# Altium project Hands_free_ControlUnit_V1.PrjPCB
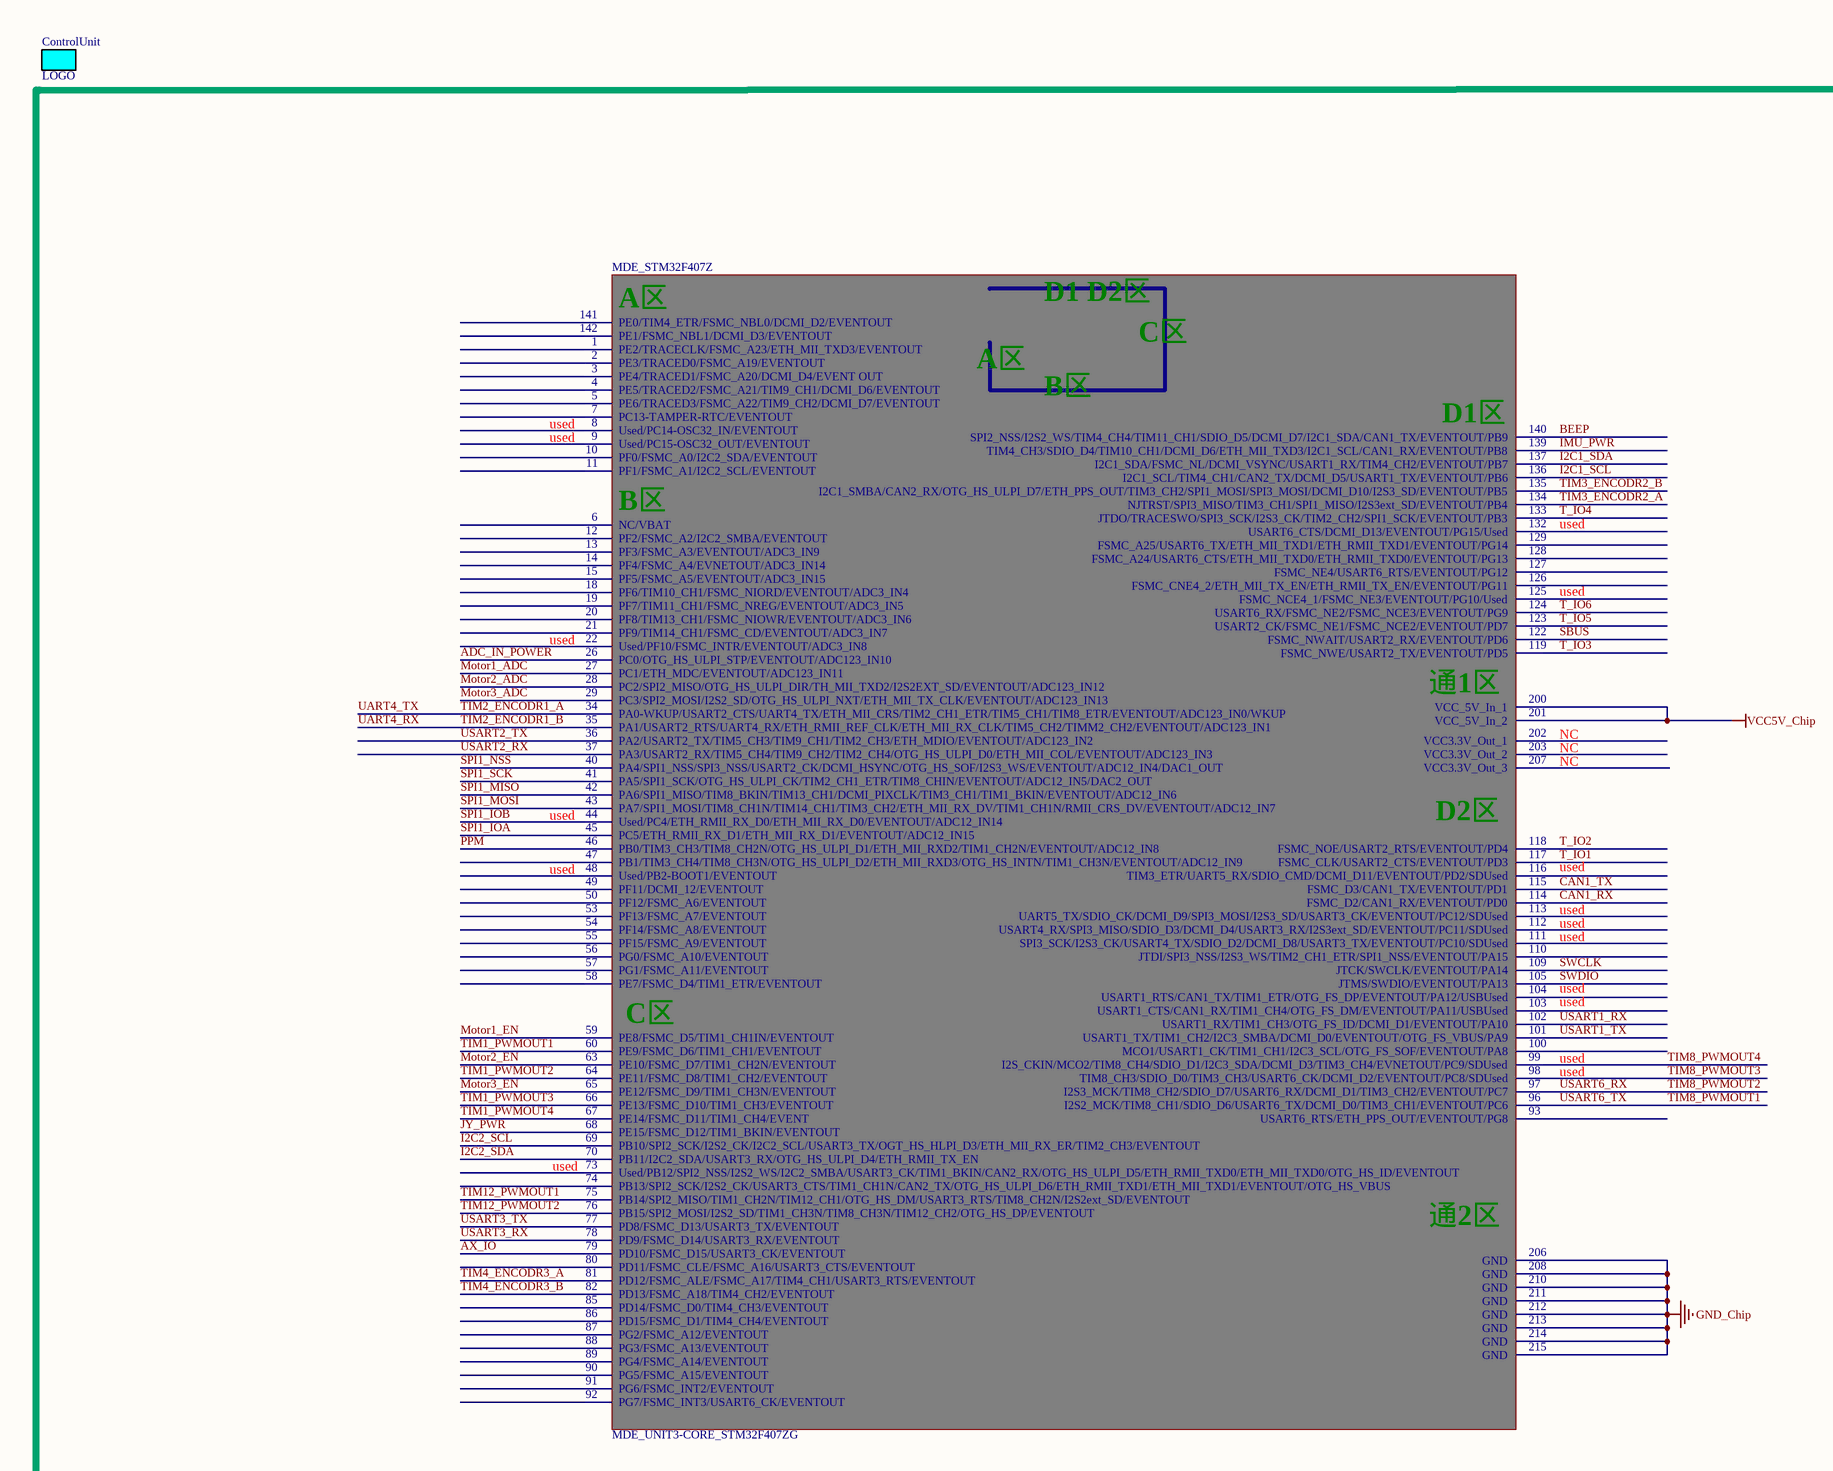
[diagram p0: Hands_free_ControlUnit_V1.SchDoc, top left]
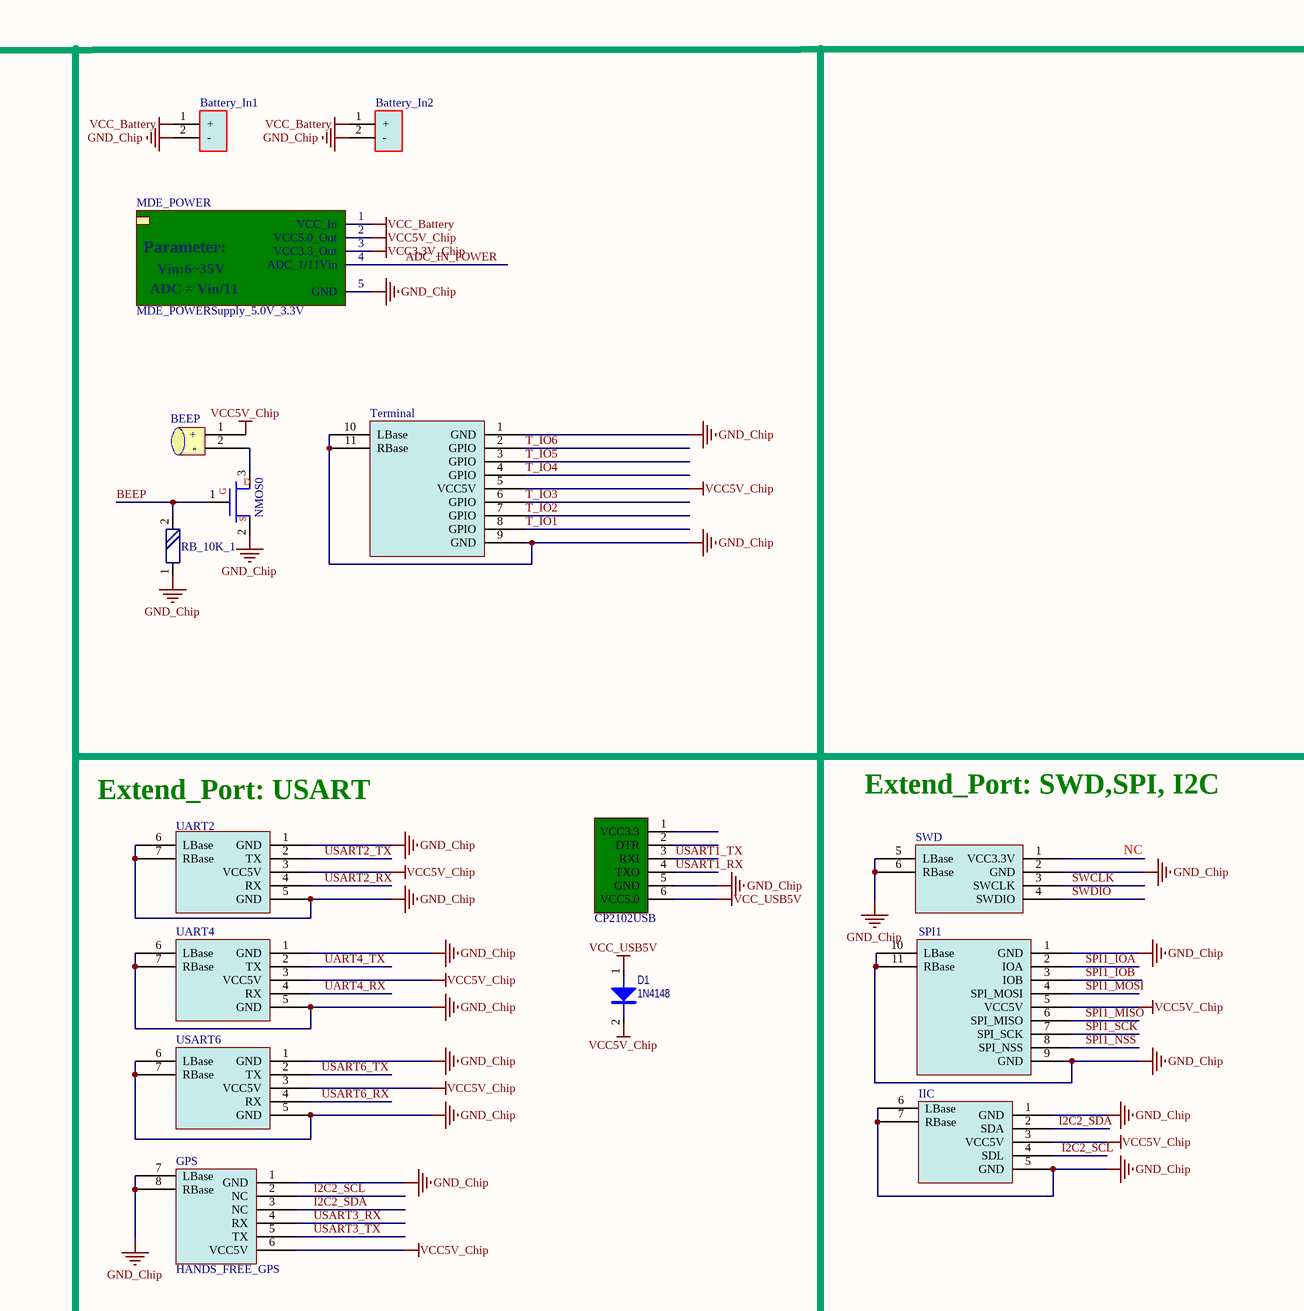
[diagram p1: Hands_free_ControlUnit_V1.SchDoc, top middle]
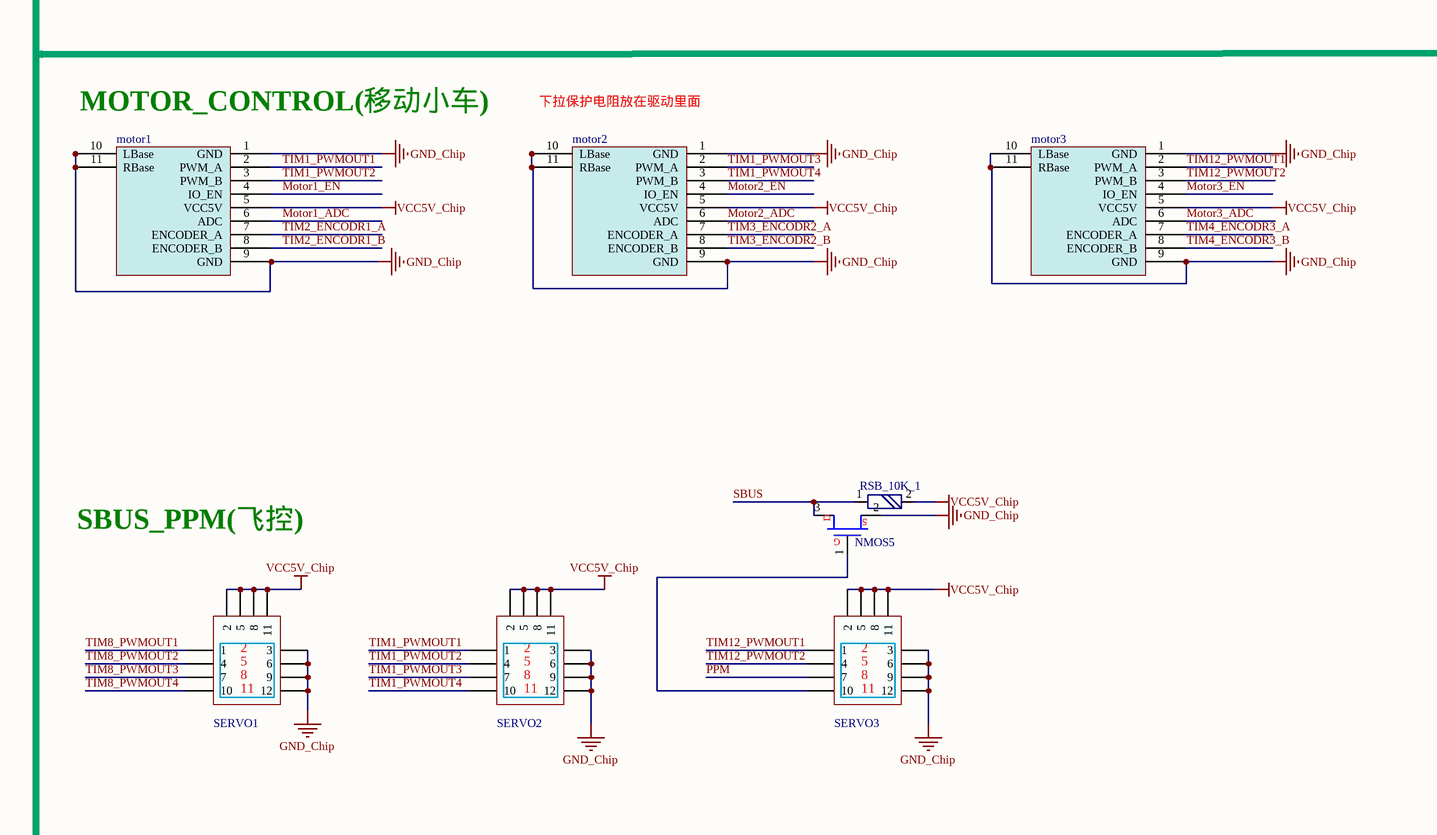
[diagram p2: Hands_free_ControlUnit_V1.SchDoc, bottom left]
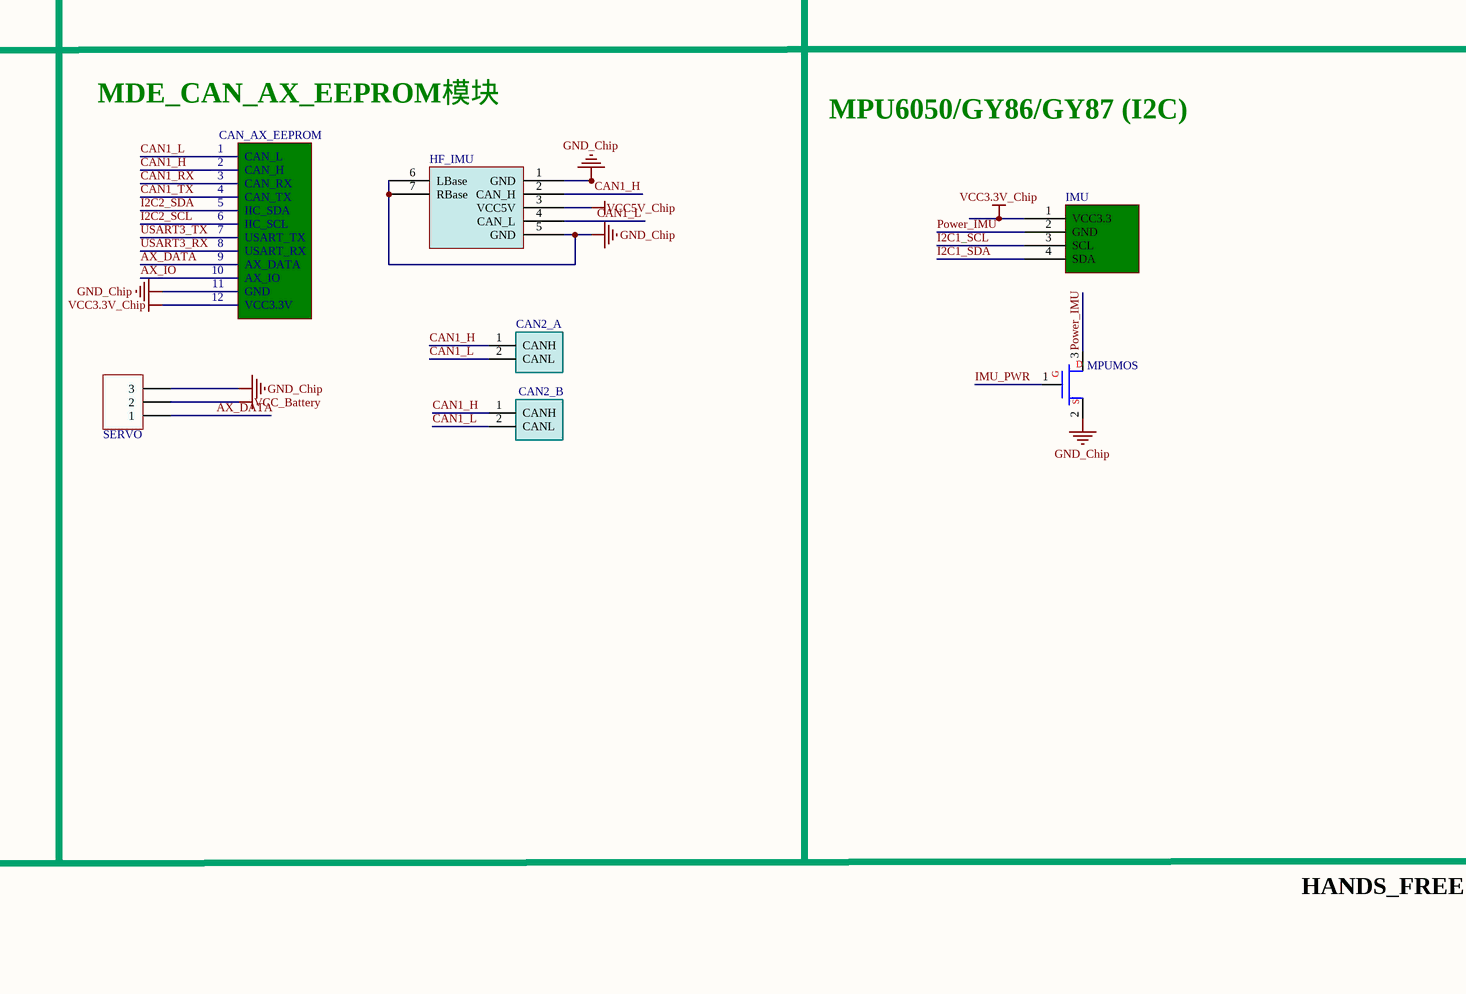
[diagram p3: Hands_free_ControlUnit_V1.SchDoc, bottom middle]
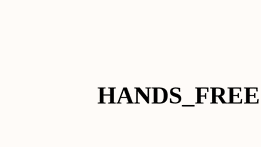
[diagram p4: Hands_free_ControlUnit_V1.SchDoc, bottom right]
1 sheet, 33 parts. Net scope: global (net labels, ports and power ports of the same name join across sheets).
Board file: Hands_free_ControlUnit_V1.PcbDoc

## Sheet Hands_free_ControlUnit_V1.SchDoc
size A0

### Parts
Battery_In1  HDR_Header_Power_2P  [HDR_MOLEX_POWER5557_DH_2P]  (value not drawn)
Battery_In2  HDR_Header_Power_2P  [HDR_MOLEX_POWER5557_DH_2P]  (value not drawn)
BEEP  ELE_蜂鸣器12*X  [ELE_蜂鸣器_D_12*X]  (value not drawn)
CAN2_A  HDR_HEADER_CAN_DH_2P  [HDR_MOLEX_CANMX3.0_DH_2P]  (value not drawn)
CAN2_B  HDR_HEADER_CAN_DH_2P  [HDR_MOLEX_CANMX3.0_DH_2P]  (value not drawn)
CAN_AX_EEPROM  MDE_CAN_AX_EEPROM  [MDE_CAN_AX_EEPROM]  (value not drawn)
ControlUnit  LOGO  [LOGO]
CP2102USB  MDE_CP2102-TTLUSB  [MDE_CP2102-TTLUSB_BASE]  (value not drawn)
D1  1N4148  [ELE_D1206]
GPS  HANDS_FREE_GPS  [HDR_Molex_PH_1.25_6P]
HF_IMU  HANDS_FREE_IMU  [HDR_Molex_PH_1.25_5P]  (value not drawn)
IIC  HANDS_FREE_IIC  [HDR_Molex_PH_1.25_5P]  (value not drawn)
IMU  MDE_GY86_87  [MDE_GY86_GY87_BASE]  (value not drawn)
MDE_POWER  MDE_POWERSupply_5.0V_3.3V  [MDE_POWERSupply_5.0V_3.3V]
MDE_STM32F407Z  MDE_UNIT3-CORE_STM32F407ZG  [MDE_UNIT3-CORE_STM32F407ZG]
motor1  *MOTOR  [HDR_Molex_PH_1.25_9P]  (value not drawn)
motor2  *MOTOR  [HDR_Molex_PH_1.25_9P]  (value not drawn)
motor3  *MOTOR  [HDR_Molex_PH_1.25_9P]  (value not drawn)
MPUMOS  SIS412DN  [CHP_SOT23_P_3P]  (value not drawn)
NMOS0  SIS412DN  [CHP_SOT23_P_3P]  (value not drawn)
NMOS5  SIS412DN  [CHP_SOT23_P_3P]  (value not drawn)
RB_10K_1  ELE_RES_1  [ELE_0805_P]  (value not drawn)
RSB_10K_1  ELE_RES_1  [ELE_0805_P]  (value not drawn)
SERVO  HDR_Header_1*3  [HDR_数字舵机接口_D]  (value not drawn)
SERVO1  HDR_Header_4*3  [HDR_Header_3.00_DV_3*4]  (value not drawn)
SERVO2  HDR_Header_4*3  [HDR_Header_3.00_DV_3*4]  (value not drawn)
SERVO3  HDR_Header_4*3  [HDR_Header_3.00_DV_3*4]  (value not drawn)
SPI1  HANDS_FREE_SPI  [HDR_Molex_PH_1.25_9P]  (value not drawn)
SWD  HANDS_FREE_SWD  [HDR_Molex_PH_1.25_4P]  (value not drawn)
Terminal  HANDS_FREE_TERMINAL  [HDR_Molex_PH_1.25_9P]  (value not drawn)
UART2  HANDS_FREE_USART  [HDR_Molex_PH_1.25_5P]  (value not drawn)
UART4  HANDS_FREE_USART  [HDR_Molex_PH_1.25_5P]  (value not drawn)
USART6  HANDS_FREE_USART  [HDR_Molex_PH_1.25_5P]  (value not drawn)

### Nets
GND_Chip: Battery_In1.2(-) Battery_In2.2(-) CAN_AX_EEPROM.11(GND) CP2102USB.5(GND) GPS.1(GND) GPS.7(LBase) GPS.8(RBase) HF_IMU.1(GND) HF_IMU.5(GND) HF_IMU.6(LBase) HF_IMU.7(RBase) IIC.1(GND) IIC.5(GND) IIC.6(LBase) IIC.7(RBase) MDE_POWER.5(GND) MDE_STM32F407Z.206(GND) MDE_STM32F407Z.208(GND) MDE_STM32F407Z.210(GND) MDE_STM32F407Z.211(GND) MDE_STM32F407Z.212(GND) MDE_STM32F407Z.213(GND) MDE_STM32F407Z.214(GND) MDE_STM32F407Z.215(GND) motor1.1(GND) motor1.9(GND) motor1.10(LBase) motor1.11(RBase) motor2.1(GND) motor2.9(GND) motor2.10(LBase) motor2.11(RBase) motor3.1(GND) motor3.9(GND) motor3.10(LBase) motor3.11(RBase) MPUMOS.2(S) NMOS0.2(S) NMOS5.2(S) RB_10K_1.1 SERVO.3 SERVO1.3 SERVO1.6 SERVO1.9 SERVO1.12 SERVO2.3 SERVO2.6 SERVO2.9 SERVO2.12 SERVO3.3 SERVO3.6 SERVO3.9 SERVO3.12 SPI1.1(GND) SPI1.9(GND) SPI1.10(LBase) SPI1.11(RBase) SWD.2(GND) SWD.5(LBase) SWD.6(RBase) Terminal.1(GND) Terminal.9(GND) Terminal.10(LBase) Terminal.11(RBase) UART2.1(GND) UART2.5(GND) UART2.6(LBase) UART2.7(RBase) UART4.1(GND) UART4.5(GND) UART4.6(LBase) UART4.7(RBase) USART6.1(GND) USART6.5(GND) USART6.6(LBase) USART6.7(RBase)
VCC3.3V_Chip: CAN_AX_EEPROM.12(VCC3.3V) IMU.1(VCC3.3) MDE_POWER.3(VCC3.3_Out)
VCC5V_Chip: BEEP.1(+) D1.2 GPS.6(VCC5V) HF_IMU.3(VCC5V) IIC.3(VCC5V) MDE_POWER.2(VCC5.0_Out) MDE_STM32F407Z.200(VCC_5V_In_1) MDE_STM32F407Z.201(VCC_5V_In_2) motor1.5(VCC5V) motor2.5(VCC5V) motor3.5(VCC5V) RSB_10K_1.2 SERVO1.2 SERVO1.5 SERVO1.8 SERVO1.11 SERVO2.2 SERVO2.5 SERVO2.8 SERVO2.11 SERVO3.2 SERVO3.5 SERVO3.8 SERVO3.11 SPI1.5(VCC5V) Terminal.5(VCC5V) UART2.3(VCC5V) UART4.3(VCC5V) USART6.3(VCC5V)
VCC_Battery: Battery_In1.1(+) Battery_In2.1(+) MDE_POWER.1(VCC_In) SERVO.2
VCC_USB5V: CP2102USB.6(VCC5.0) D1.1
ADC_IN_POWER: MDE_POWER.4(ADC_1/11Vin) MDE_STM32F407Z.26(PC0/OTG_HS_ULPI_STP/EVENTOUT/ADC123_IN10)
AX_DATA: CAN_AX_EEPROM.9(AX_DATA) SERVO.1
AX_IO: CAN_AX_EEPROM.10(AX_IO) MDE_STM32F407Z.79(PD10/FSMC_D15/USART3_CK/EVENTOUT)
BEEP: MDE_STM32F407Z.140(SPI2_NSS/I2S2_WS/TIM4_CH4/TIM11_CH1/SDIO_D5/DCMI_D7/I2C1_SDA/CAN1_TX/EVENTOUT/PB9) NMOS0.1(G) RB_10K_1.2
CAN1_H: CAN2_A.1(CANH) CAN2_B.1(CANH) CAN_AX_EEPROM.2(CAN_H) HF_IMU.2(CAN_H)
CAN1_L: CAN2_A.2(CANL) CAN2_B.2(CANL) CAN_AX_EEPROM.1(CAN_L) HF_IMU.4(CAN_L)
CAN1_RX: CAN_AX_EEPROM.3(CAN_RX) MDE_STM32F407Z.114(FSMC_D2/CAN1_RX/EVENTOUT/PD0)
CAN1_TX: CAN_AX_EEPROM.4(CAN_TX) MDE_STM32F407Z.115(FSMC_D3/CAN1_TX/EVENTOUT/PD1)
I2C1_SCL: IMU.3(SCL) MDE_STM32F407Z.136(I2C1_SCL/TIM4_CH1/CAN2_TX/DCMI_D5/USART1_TX/EVENTOUT/PB6)
I2C1_SDA: IMU.4(SDA) MDE_STM32F407Z.137(I2C1_SDA/FSMC_NL/DCMI_VSYNC/USART1_RX/TIM4_CH2/EVENTOUT/PB7)
I2C2_SCL: CAN_AX_EEPROM.6(IIC_SCL) GPS.2(NC) IIC.4(SDL) MDE_STM32F407Z.69(PB10/SPI2_SCK/I2S2_CK/I2C2_SCL/USART3_TX/OGT_HS_HLPI_D3/ETH_MII_RX_ER/TIM2_CH3/EVENTOUT)
I2C2_SDA: CAN_AX_EEPROM.5(IIC_SDA) GPS.3(NC) IIC.2(SDA) MDE_STM32F407Z.70(PB11/I2C2_SDA/USART3_RX/OTG_HS_ULPI_D4/ETH_RMII_TX_EN)
IMU_PWR: MDE_STM32F407Z.139(TIM4_CH3/SDIO_D4/TIM10_CH1/DCMI_D6/ETH_MII_TXD3/I2C1_SCL/CAN1_RX/EVENTOUT/PB8) MPUMOS.1(G)
JY_PWR: MDE_STM32F407Z.68(PE15/FSMC_D12/TIM1_BKIN/EVENTOUT)
Motor1_ADC: MDE_STM32F407Z.27(PC1/ETH_MDC/EVENTOUT/ADC123_IN11) motor1.6(ADC)
Motor1_EN: MDE_STM32F407Z.59(PE8/FSMC_D5/TIM1_CH1IN/EVENTOUT) motor1.4(IO_EN)
Motor2_ADC: MDE_STM32F407Z.28(PC2/SPI2_MISO/OTG_HS_ULPI_DIR/TH_MII_TXD2/I2S2EXT_SD/EVENTOUT/ADC123_IN12) motor2.6(ADC)
Motor2_EN: MDE_STM32F407Z.63(PE10/FSMC_D7/TIM1_CH2N/EVENTOUT) motor2.4(IO_EN)
Motor3_ADC: MDE_STM32F407Z.29(PC3/SPI2_MOSI/I2S2_SD/OTG_HS_ULPI_NXT/ETH_MII_TX_CLK/EVENTOUT/ADC123_IN13) motor3.6(ADC)
Motor3_EN: MDE_STM32F407Z.65(PE12/FSMC_D9/TIM1_CH3N/EVENTOUT) motor3.4(IO_EN)
Power_IMU: IMU.2(GND) MPUMOS.3(D)
PPM: MDE_STM32F407Z.46(PB0/TIM3_CH3/TIM8_CH2N/OTG_HS_ULPI_D1/ETH_MII_RXD2/TIM1_CH2N/EVENTOUT/ADC12_IN8) SERVO3.7
SBUS: MDE_STM32F407Z.122(FSMC_NWAIT/USART2_RX/EVENTOUT/PD6) NMOS5.3(D) RSB_10K_1.1
SPI1_IOA: MDE_STM32F407Z.45(PC5/ETH_RMII_RX_D1/ETH_MII_RX_D1/EVENTOUT/ADC12_IN15) SPI1.2(IOA)
SPI1_IOB: MDE_STM32F407Z.44(Used/PC4/ETH_RMII_RX_D0/ETH_MII_RX_D0/EVENTOUT/ADC12_IN14) SPI1.3(IOB)
SPI1_MISO: MDE_STM32F407Z.42(PA6/SPI1_MISO/TIM8_BKIN/TIM13_CH1/DCMI_PIXCLK/TIM3_CH1/TIM1_BKIN/EVENTOUT/ADC12_IN6) SPI1.6(SPI_MISO)
SPI1_MOSI: MDE_STM32F407Z.43(PA7/SPI1_MOSI/TIM8_CH1N/TIM14_CH1/TIM3_CH2/ETH_MII_RX_DV/TIM1_CH1N/RMII_CRS_DV/EVENTOUT/ADC12_IN7) SPI1.4(SPI_MOSI)
SPI1_NSS: MDE_STM32F407Z.40(PA4/SPI1_NSS/SPI3_NSS/USART2_CK/DCMI_HSYNC/OTG_HS_SOF/I2S3_WS/EVENTOUT/ADC12_IN4/DAC1_OUT) SPI1.8(SPI_NSS)
SPI1_SCK: MDE_STM32F407Z.41(PA5/SPI1_SCK/OTG_HS_ULPI_CK/TIM2_CH1_ETR/TIM8_CHIN/EVENTOUT/ADC12_IN5/DAC2_OUT) SPI1.7(SPI_SCK)
SWCLK: MDE_STM32F407Z.109(JTCK/SWCLK/EVENTOUT/PA14) SWD.3(SWCLK)
SWDIO: MDE_STM32F407Z.105(JTMS/SWDIO/EVENTOUT/PA13) SWD.4(SWDIO)
T_IO1: MDE_STM32F407Z.117(FSMC_CLK/USART2_CTS/EVENTOUT/PD3) Terminal.8(GPIO)
T_IO2: MDE_STM32F407Z.118(FSMC_NOE/USART2_RTS/EVENTOUT/PD4) Terminal.7(GPIO)
T_IO3: MDE_STM32F407Z.119(FSMC_NWE/USART2_TX/EVENTOUT/PD5) Terminal.6(GPIO)
T_IO4: MDE_STM32F407Z.133(JTDO/TRACESWO/SPI3_SCK/I2S3_CK/TIM2_CH2/SPI1_SCK/EVENTOUT/PB3) Terminal.4(GPIO)
T_IO5: MDE_STM32F407Z.123(USART2_CK/FSMC_NE1/FSMC_NCE2/EVENTOUT/PD7) Terminal.3(GPIO)
T_IO6: MDE_STM32F407Z.124(USART6_RX/FSMC_NE2/FSMC_NCE3/EVENTOUT/PG9) Terminal.2(GPIO)
TIM1_PWMOUT1: MDE_STM32F407Z.60(PE9/FSMC_D6/TIM1_CH1/EVENTOUT) motor1.2(PWM_A) SERVO2.1
TIM1_PWMOUT2: MDE_STM32F407Z.64(PE11/FSMC_D8/TIM1_CH2/EVENTOUT) motor1.3(PWM_B) SERVO2.4
TIM1_PWMOUT3: MDE_STM32F407Z.66(PE13/FSMC_D10/TIM1_CH3/EVENTOUT) motor2.2(PWM_A) SERVO2.7
TIM1_PWMOUT4: MDE_STM32F407Z.67(PE14/FSMC_D11/TIM1_CH4/EVENT) motor2.3(PWM_B) SERVO2.10
TIM2_ENCODR1_A: MDE_STM32F407Z.34(PA0-WKUP/USART2_CTS/UART4_TX/ETH_MII_CRS/TIM2_CH1_ETR/TIM5_CH1/TIM8_ETR/EVENTOUT/ADC123_IN0/WKUP) motor1.7(ENCODER_A) UART4.2(TX)  [also labelled UART4_TX]
TIM2_ENCODR1_B: MDE_STM32F407Z.35(PA1/USART2_RTS/UART4_RX/ETH_RMII_REF_CLK/ETH_MII_RX_CLK/TIM5_CH2/TIMM2_CH2/EVENTOUT/ADC123_IN1) motor1.8(ENCODER_B) UART4.4(RX)  [also labelled UART4_RX]
TIM3_ENCODR2_A: MDE_STM32F407Z.134(NJTRST/SPI3_MISO/TIM3_CH1/SPI1_MISO/I2S3ext_SD/EVENTOUT/PB4) motor2.7(ENCODER_A)
TIM3_ENCODR2_B: MDE_STM32F407Z.135(I2C1_SMBA/CAN2_RX/OTG_HS_ULPI_D7/ETH_PPS_OUT/TIM3_CH2/SPI1_MOSI/SPI3_MOSI/DCMI_D10/I2S3_SD/EVENTOUT/PB5) motor2.8(ENCODER_B)
TIM4_ENCODR3_A: MDE_STM32F407Z.81(PD12/FSMC_ALE/FSMC_A17/TIM4_CH1/USART3_RTS/EVENTOUT) motor3.7(ENCODER_A)
TIM4_ENCODR3_B: MDE_STM32F407Z.82(PD13/FSMC_A18/TIM4_CH2/EVENTOUT) motor3.8(ENCODER_B)
TIM8_PWMOUT1: MDE_STM32F407Z.96(I2S2_MCK/TIM8_CH1/SDIO_D6/USART6_TX/DCMI_D0/TIM3_CH1/EVENTOUT/PC6) SERVO1.1 USART6.2(TX)  [also labelled USART6_TX]
TIM8_PWMOUT2: MDE_STM32F407Z.97(I2S3_MCK/TIM8_CH2/SDIO_D7/USART6_RX/DCMI_D1/TIM3_CH2/EVENTOUT/PC7) SERVO1.4 USART6.4(RX)  [also labelled USART6_RX]
TIM8_PWMOUT3: MDE_STM32F407Z.98(TIM8_CH3/SDIO_D0/TIM3_CH3/USART6_CK/DCMI_D2/EVENTOUT/PC8/SDUsed) SERVO1.7
TIM8_PWMOUT4: MDE_STM32F407Z.99(I2S_CKIN/MCO2/TIM8_CH4/SDIO_D1/I2C3_SDA/DCMI_D3/TIM3_CH4/EVNETOUT/PC9/SDUsed) SERVO1.10
TIM12_PWMOUT1: MDE_STM32F407Z.75(PB14/SPI2_MISO/TIM1_CH2N/TIM12_CH1/OTG_HS_DM/USART3_RTS/TIM8_CH2N/I2S2ext_SD/EVENTOUT) motor3.2(PWM_A) SERVO3.1
TIM12_PWMOUT2: MDE_STM32F407Z.76(PB15/SPI2_MOSI/I2S2_SD/TIM1_CH3N/TIM8_CH3N/TIM12_CH2/OTG_HS_DP/EVENTOUT) motor3.3(PWM_B) SERVO3.4
USART1_RX: CP2102USB.4(TXO) MDE_STM32F407Z.102(USART1_RX/TIM1_CH3/OTG_FS_ID/DCMI_D1/EVENTOUT/PA10)
USART1_TX: CP2102USB.3(RXI) MDE_STM32F407Z.101(USART1_TX/TIM1_CH2/I2C3_SMBA/DCMI_D0/EVENTOUT/OTG_FS_VBUS/PA9)
USART2_RX: MDE_STM32F407Z.37(PA3/USART2_RX/TIM5_CH4/TIM9_CH2/TIM2_CH4/OTG_HS_ULPI_D0/ETH_MII_COL/EVENTOUT/ADC123_IN3) UART2.4(RX)
USART2_TX: MDE_STM32F407Z.36(PA2/USART2_TX/TIM5_CH3/TIM9_CH1/TIM2_CH3/ETH_MDIO/EVENTOUT/ADC123_IN2) UART2.2(TX)
USART3_RX: CAN_AX_EEPROM.8(USART_RX) GPS.4(RX) MDE_STM32F407Z.78(PD9/FSMC_D14/USART3_RX/EVENTOUT)
USART3_TX: CAN_AX_EEPROM.7(USART_TX) GPS.5(TX) MDE_STM32F407Z.77(PD8/FSMC_D13/USART3_TX/EVENTOUT)
NetBEEP_2: BEEP.2(-) NMOS0.3(D)
NetNMOS5_1: NMOS5.1(G) SERVO3.10

Not connected (* = marked no-connect by the designer): CP2102USB 1(VCC3.3) 2(DTR); MDE_STM32F407Z 1(PE2/TRACECLK/FSMC_A23/ETH_MII_TXD3/EVENTOUT) 2(PE3/TRACED0/FSMC_A19/EVENTOUT) 3(PE4/TRACED1/FSMC_A20/DCMI_D4/EVENT_OUT) 4(PE5/TRACED2/FSMC_A21/TIM9_CH1/DCMI_D6/EVENTOUT) 5(PE6/TRACED3/FSMC_A22/TIM9_CH2/DCMI_D7/EVENTOUT) 6(NC/VBAT) 7(PC13-TAMPER-RTC/EVENTOUT) 8(Used/PC14-OSC32_IN/EVENTOUT) 9(Used/PC15-OSC32_OUT/EVENTOUT) 10(PF0/FSMC_A0/I2C2_SDA/EVENTOUT) 11(PF1/FSMC_A1/I2C2_SCL/EVENTOUT) 12(PF2/FSMC_A2/I2C2_SMBA/EVENTOUT) 13(PF3/FSMC_A3/EVENTOUT/ADC3_IN9) 14(PF4/FSMC_A4/EVNETOUT/ADC3_IN14) 15(PF5/FSMC_A5/EVENTOUT/ADC3_IN15) 18(PF6/TIM10_CH1/FSMC_NIORD/EVENTOUT/ADC3_IN4) 19(PF7/TIM11_CH1/FSMC_NREG/EVENTOUT/ADC3_IN5) 20(PF8/TIM13_CH1/FSMC_NIOWR/EVENTOUT/ADC3_IN6) 21(PF9/TIM14_CH1/FSMC_CD/EVENTOUT/ADC3_IN7) 22(Used/PF10/FSMC_INTR/EVENTOUT/ADC3_IN8) 47(PB1/TIM3_CH4/TIM8_CH3N/OTG_HS_ULPI_D2/ETH_MII_RXD3/OTG_HS_INTN/TIM1_CH3N/EVENTOUT/ADC12_IN9) 48(Used/PB2-BOOT1/EVENTOUT) 49(PF11/DCMI_12/EVENTOUT) 50(PF12/FSMC_A6/EVENTOUT) 53(PF13/FSMC_A7/EVENTOUT) 54(PF14/FSMC_A8/EVENTOUT) 55(PF15/FSMC_A9/EVENTOUT) 56(PG0/FSMC_A10/EVENTOUT) 57(PG1/FSMC_A11/EVENTOUT) 58(PE7/FSMC_D4/TIM1_ETR/EVENTOUT) 73(Used/PB12/SPI2_NSS/I2S2_WS/I2C2_SMBA/USART3_CK/TIM1_BKIN/CAN2_RX/OTG_HS_ULPI_D5/ETH_RMII_TXD0/ETH_MII_TXD0/OTG_HS_ID/EVENTOUT) 74(PB13/SPI2_SCK/I2S2_CK/USART3_CTS/TIM1_CH1N/CAN2_TX/OTG_HS_ULPI_D6/ETH_RMII_TXD1/ETH_MII_TXD1/EVENTOUT/OTG_HS_VBUS) 80(PD11/FSMC_CLE/FSMC_A16/USART3_CTS/EVENTOUT) 85(PD14/FSMC_D0/TIM4_CH3/EVENTOUT) 86(PD15/FSMC_D1/TIM4_CH4/EVENTOUT) 87(PG2/FSMC_A12/EVENTOUT) 88(PG3/FSMC_A13/EVENTOUT) 89(PG4/FSMC_A14/EVENTOUT) 90(PG5/FSMC_A15/EVENTOUT) 91(PG6/FSMC_INT2/EVENTOUT) 92(PG7/FSMC_INT3/USART6_CK/EVENTOUT) 93(USART6_RTS/ETH_PPS_OUT/EVENTOUT/PG8) 100(MCO1/USART1_CK/TIM1_CH1/I2C3_SCL/OTG_FS_SOF/EVENTOUT/PA8) 103(USART1_CTS/CAN1_RX/TIM1_CH4/OTG_FS_DM/EVENTOUT/PA11/USBUsed) 104(USART1_RTS/CAN1_TX/TIM1_ETR/OTG_FS_DP/EVENTOUT/PA12/USBUsed) 110(JTDI/SPI3_NSS/I2S3_WS/TIM2_CH1_ETR/SPI1_NSS/EVENTOUT/PA15) 111(SPI3_SCK/I2S3_CK/USART4_TX/SDIO_D2/DCMI_D8/USART3_TX/EVENTOUT/PC10/SDUsed) 112(USART4_RX/SPI3_MISO/SDIO_D3/DCMI_D4/USART3_RX/I2S3ext_SD/EVENTOUT/PC11/SDUsed) 113(UART5_TX/SDIO_CK/DCMI_D9/SPI3_MOSI/I2S3_SD/USART3_CK/EVENTOUT/PC12/SDUsed) 116(TIM3_ETR/UART5_RX/SDIO_CMD/DCMI_D11/EVENTOUT/PD2/SDUsed) 125(FSMC_NCE4_1/FSMC_NE3/EVENTOUT/PG10/Used) 126(FSMC_CNE4_2/ETH_MII_TX_EN/ETH_RMII_TX_EN/EVENTOUT/PG11) 127(FSMC_NE4/USART6_RTS/EVENTOUT/PG12) 128(FSMC_A24/USART6_CTS/ETH_MII_TXD0/ETH_RMII_TXD0/EVENTOUT/PG13) 129(FSMC_A25/USART6_TX/ETH_MII_TXD1/ETH_RMII_TXD1/EVENTOUT/PG14) 132(USART6_CTS/DCMI_D13/EVENTOUT/PG15/Used) 141(PE0/TIM4_ETR/FSMC_NBL0/DCMI_D2/EVENTOUT) 142(PE1/FSMC_NBL1/DCMI_D3/EVENTOUT) 202(VCC3.3V_Out_1) 203(VCC3.3V_Out_2) 207(VCC3.3V_Out_3); SWD 1(VCC3.3V)

### Notes on the sheet
- (near MDE_STM32F407Z) used
- (near MDE_STM32F407Z) NC
- (near UART2) Extend_Port: USART
- Extend_Port: SWD,SPI, I2C
- NC
- (near motor1) MOTOR_CONTROL(移动小车)
- (near motor2) 下拉保护电阻放在驱动里面
- (near CAN_AX_EEPROM) MDE_CAN_AX_EEPROM模块
- MPU6050/GY86/GY87 (I2C)
- SBUS_PPM(飞控)
- HANDS_FREE
- (in symbol MDE_POWERSupply_5.0V_3.3V) Parameter:; Vin:6~35V; ADC = Vin/11
- (in symbol MDE_UNIT3-CORE_STM32F407ZG) D1 D2区; A区; C区; B区; D1区; 通1区; D2区; 通2区

### Library data of the parts
CP2102USB = MDE_CP2102-TTLUSB: CP2102模块，TTL-USB
D1 = ELE_Diode: 二极管
IMU = MDE_GY86_87: IMU模块
motor1-motor3 = HANDS_FREE_MOTOR
MPUMOS NMOS0 NMOS5 = ELE_NMOS_1: MOS管; Note: Pin 2 is electrically connected to pin 4.; Published: 8-Jun-2000; LatestRevisionDate: 17-Jul-2002; LatestRevisionNote: Re-released for DXP Platform.; DatasheetDocument: PD-9.814; PackageReference: TO-220AB; Publisher: Altium Limited; Code_JEDEC: TO-220-AB; ComponentLink1Description: Manufacturer Link; ComponentLink1URL: http://www.irf.com/
RB_10K_1 RSB_10K_1 = ELE_RES_1: 电阻
SERVO = HDR_Header_1*3: LatestRevisionDate: 17-Jul-2002; LatestRevisionNote: Re-released for DXP Platform.; Publisher: Altium Limited